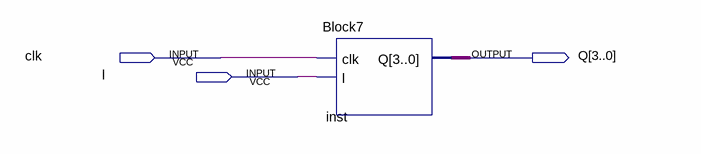
[diagram p0: schematic sheet]
// Quartus schematic Block1.bdf as structural Verilog: 1 symbols, 3 pins
module Block1 (
  input  clk,
  input  l,
  output [3:0] Q
);

  Block7 inst (.clk(clk), .l(l), .Q(Q));
endmodule
